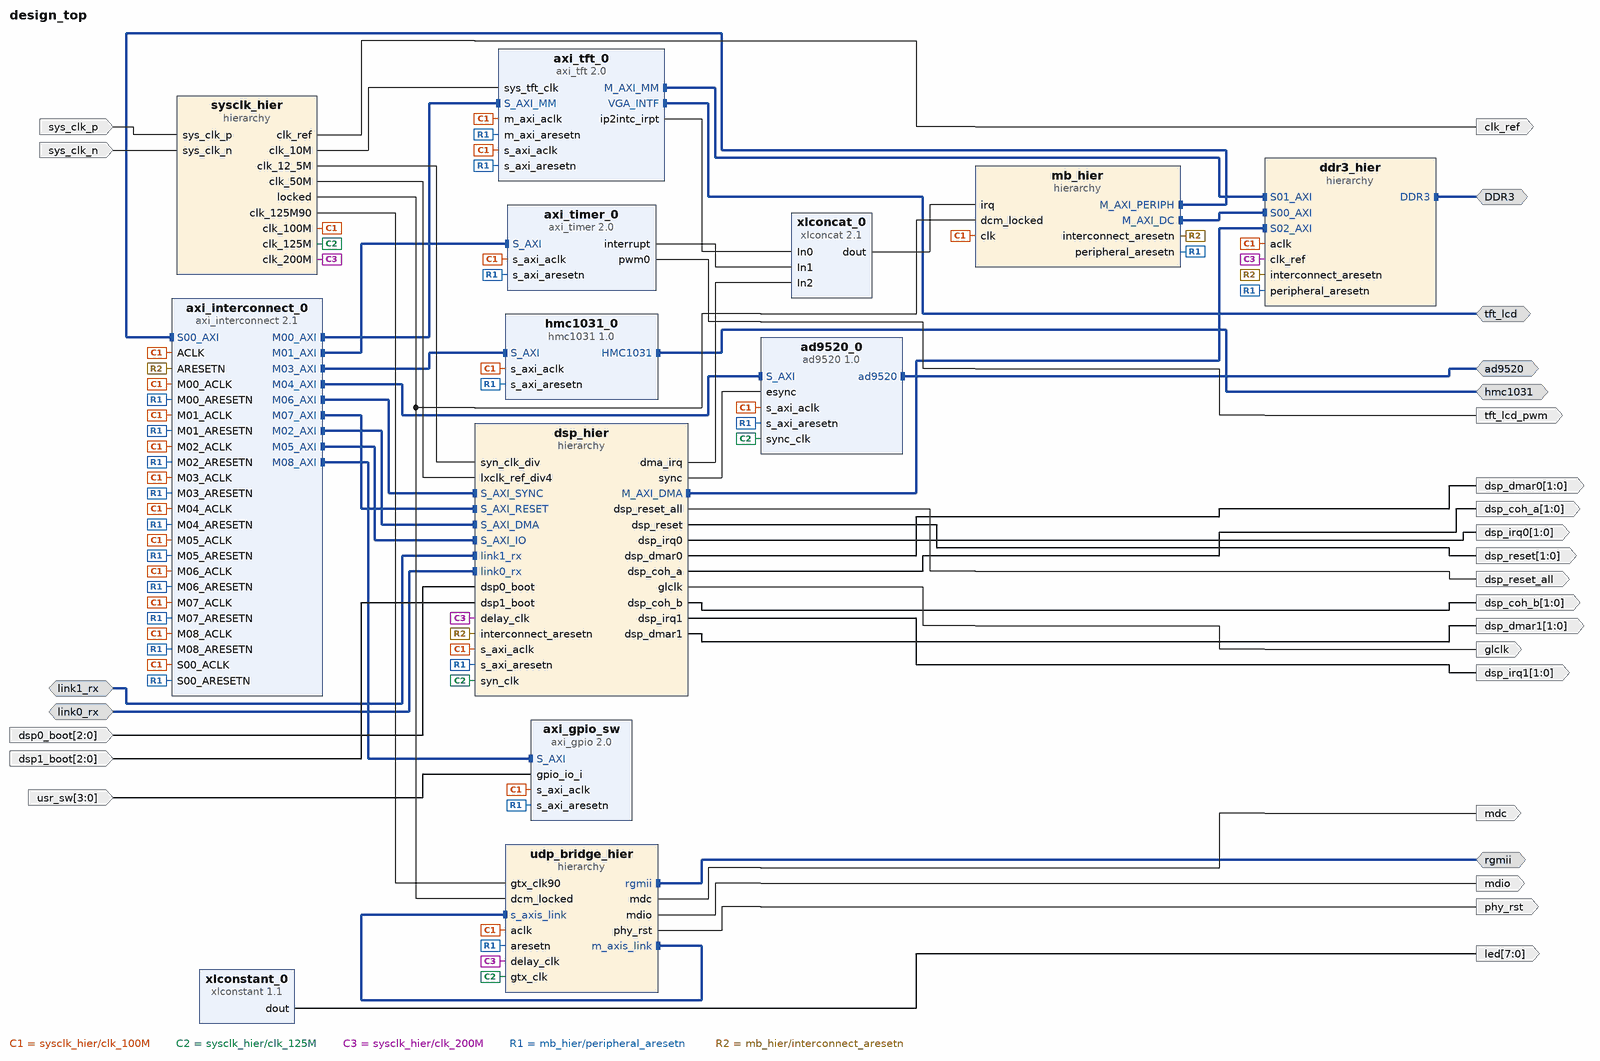
[diagram p0: block diagram of the top level]
# Vivado block design design_top, xc7a200tfbg484-2, Vivado 2018.3
create_bd_design design_top

create_bd_intf_port -mode Master -vlnv xilinx.com:interface:rgmii_rtl:1.0 rgmii
create_bd_intf_port -mode Master -vlnv xilinx.com:interface:ddrx_rtl:1.0 DDR3
create_bd_intf_port -mode Master -vlnv xilinx.com:interface:vga_rtl:1.0 tft_lcd
create_bd_intf_port -mode Slave -vlnv milandr.ru:interface:link_io_rtl:1.0 link0_rx
create_bd_intf_port -mode Slave -vlnv milandr.ru:interface:link_io_rtl:1.0 link1_rx
create_bd_intf_port -mode Master -vlnv milandr.ru:interface:hmc1031_rtl:1.0 hmc1031
create_bd_intf_port -mode Master -vlnv milandr.ru:interface:ad9520_io_rtl:1.0 ad9520
create_bd_port -dir I -type clk sys_clk_p
set_property -dict {CONFIG.FREQ_HZ 125000000} [get_bd_ports sys_clk_p]
create_bd_port -dir I -type clk sys_clk_n
set_property -dict {CONFIG.FREQ_HZ 125000000} [get_bd_ports sys_clk_n]
create_bd_port -dir O -from 7 -to 0 led
create_bd_port -dir O mdc
create_bd_port -dir O mdio
create_bd_port -dir O -type rst phy_rst
create_bd_port -dir O tft_lcd_pwm
create_bd_port -dir I -from 3 -to 0 usr_sw
create_bd_port -dir O clk_ref
create_bd_port -dir O -type clk glclk
set_property -dict {CONFIG.FREQ_HZ 12500000} [get_bd_ports glclk]
create_bd_port -dir O dsp_reset_all
create_bd_port -dir O -from 1 -to 0 -type rst dsp_reset
create_bd_port -dir O -from 1 -to 0 dsp_irq0
create_bd_port -dir O -from 1 -to 0 dsp_irq1
create_bd_port -dir O -from 1 -to 0 dsp_dmar0
create_bd_port -dir O -from 1 -to 0 dsp_dmar1
create_bd_port -dir O -from 1 -to 0 dsp_coh_a
create_bd_port -dir O -from 1 -to 0 dsp_coh_b
create_bd_port -dir I -from 2 -to 0 dsp0_boot
create_bd_port -dir I -from 2 -to 0 dsp1_boot

create_bd_cell -type hier udp_bridge_hier
create_bd_cell -type ip -vlnv xilinx.com:ip:xlconcat:2.1 xlconcat_0
set_property -dict {CONFIG.NUM_PORTS 3} [get_bd_cells xlconcat_0]
create_bd_cell -type hier mb_hier
create_bd_cell -type hier sysclk_hier
create_bd_cell -type hier ddr3_hier
create_bd_cell -type ip -vlnv xilinx.com:ip:axi_tft:2.0 axi_tft_0
set_property -dict {CONFIG.C_EN_I2C_INTF 0 CONFIG.C_M_AXI_DATA_WIDTH 32 CONFIG.C_TFT_INTERFACE 0} [get_bd_cells axi_tft_0]
create_bd_cell -type ip -vlnv xilinx.com:ip:axi_interconnect:2.1 axi_interconnect_0
set_property -dict {CONFIG.NUM_MI 9} [get_bd_cells axi_interconnect_0]
create_bd_cell -type ip -vlnv xilinx.com:ip:axi_timer:2.0 axi_timer_0
set_property -dict {CONFIG.enable_timer2 1} [get_bd_cells axi_timer_0]
create_bd_cell -type ip -vlnv milandr.ru:ip:hmc1031:1.0 hmc1031_0
create_bd_cell -type ip -vlnv milandr.ru:ip:ad9520:1.0 ad9520_0
set_property -dict {CONFIG.IS_AD_EEPROM_PRESENT false CONFIG.SPI_CLOCK_PRESCALER 100} [get_bd_cells ad9520_0]
create_bd_cell -type hier dsp_hier
create_bd_cell -type ip -vlnv xilinx.com:ip:axi_gpio:2.0 axi_gpio_sw
set_property -dict {CONFIG.C_ALL_INPUTS 1 CONFIG.C_GPIO_WIDTH 4} [get_bd_cells axi_gpio_sw]
create_bd_cell -type ip -vlnv xilinx.com:ip:xlconstant:1.1 xlconstant_0
set_property -dict {CONFIG.CONST_VAL 0xFF CONFIG.CONST_WIDTH 8} [get_bd_cells xlconstant_0]

# ---- hierarchy /udp_bridge_hier ----
current_bd_instance /udp_bridge_hier
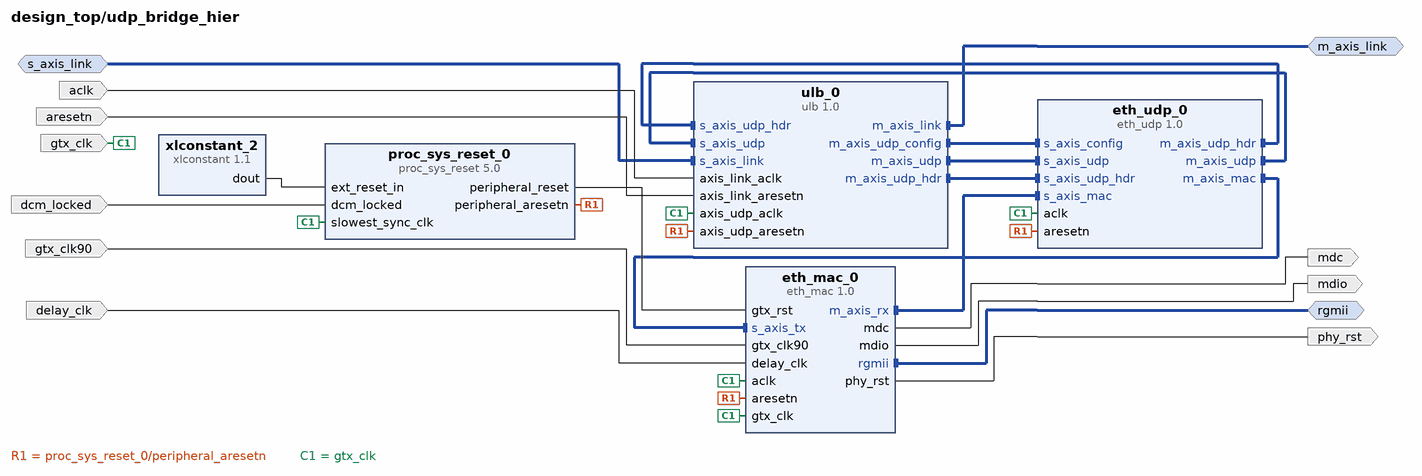
[diagram p1: block diagram inside /udp_bridge_hier]
create_bd_intf_pin -mode Master -vlnv xilinx.com:interface:rgmii_rtl:1.0 rgmii
create_bd_intf_pin -mode Slave -vlnv xilinx.com:interface:axis_rtl:1.0 s_axis_link
create_bd_intf_pin -mode Master -vlnv xilinx.com:interface:axis_rtl:1.0 m_axis_link
create_bd_pin -dir I -type clk gtx_clk
create_bd_pin -dir I -type clk aclk
create_bd_pin -dir I -type rst aresetn
create_bd_pin -dir I dcm_locked
create_bd_pin -dir I gtx_clk90
create_bd_pin -dir I -type clk delay_clk
create_bd_pin -dir O mdc
create_bd_pin -dir O mdio
create_bd_pin -dir O -type rst phy_rst

create_bd_cell -type ip -vlnv milandr.ru:ip:ulb:1.0 ulb_0
set_property -dict {CONFIG.CONFIG_ENABLE 1} [get_bd_cells ulb_0]
create_bd_cell -type ip -vlnv milandr.ru:ip:eth_udp:1.0 eth_udp_0
create_bd_cell -type ip -vlnv xilinx.com:ip:xlconstant:1.1 xlconstant_2
create_bd_cell -type ip -vlnv xilinx.com:ip:proc_sys_reset:5.0 proc_sys_reset_0
create_bd_cell -type ip -vlnv milandr.ru:ip:eth_mac:1.0 eth_mac_0
set_property -dict {CONFIG.USE_DELAY_CTRL 1} [get_bd_cells eth_mac_0]

# ---- hierarchy /mb_hier ----
current_bd_instance /mb_hier
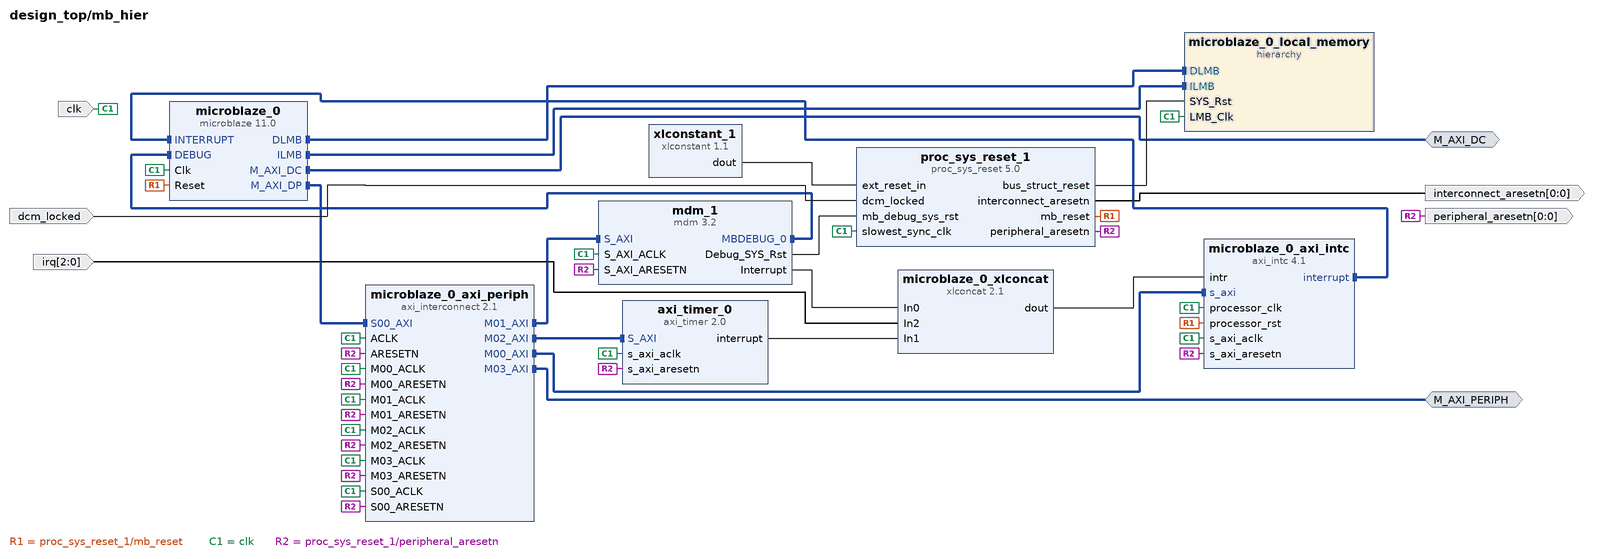
[diagram p2: block diagram inside /mb_hier]
create_bd_intf_pin -mode Master -vlnv xilinx.com:interface:aximm_rtl:1.0 M_AXI_DC
create_bd_intf_pin -mode Master -vlnv xilinx.com:interface:aximm_rtl:1.0 M_AXI_PERIPH
create_bd_pin -dir I -type clk clk
create_bd_pin -dir O -from 0 -to 0 -type rst peripheral_aresetn
create_bd_pin -dir I -from 2 -to 0 irq
create_bd_pin -dir I dcm_locked
create_bd_pin -dir O -from 0 -to 0 -type rst interconnect_aresetn

create_bd_cell -type ip -vlnv xilinx.com:ip:mdm:3.2 mdm_1
set_property -dict {CONFIG.C_ADDR_SIZE 32 CONFIG.C_M_AXI_ADDR_WIDTH 32 CONFIG.C_USE_UART 1} [get_bd_cells mdm_1]
create_bd_cell -type ip -vlnv xilinx.com:ip:xlconstant:1.1 xlconstant_1
create_bd_cell -type ip -vlnv xilinx.com:ip:xlconcat:2.1 microblaze_0_xlconcat
set_property -dict {CONFIG.NUM_PORTS 3} [get_bd_cells microblaze_0_xlconcat]
create_bd_cell -type ip -vlnv xilinx.com:ip:microblaze:11.0 microblaze_0
set_property -dict [list \
  CONFIG.C_ADDR_TAG_BITS 0 \
  CONFIG.C_DCACHE_ADDR_TAG 16 \
  CONFIG.C_DEBUG_ENABLED 1 \
  CONFIG.C_D_AXI 1 \
  CONFIG.C_D_LMB 1 \
  CONFIG.C_I_LMB 1 \
  CONFIG.C_USE_BARREL 1 \
  CONFIG.C_USE_BRANCH_TARGET_CACHE 1 \
  CONFIG.C_USE_DCACHE 1 \
  CONFIG.C_USE_DIV 1 \
  CONFIG.C_USE_FPU 2 \
  CONFIG.C_USE_HW_MUL 1 \
  CONFIG.C_USE_ICACHE 0 \
  CONFIG.C_USE_MSR_INSTR 1 \
  CONFIG.C_USE_PCMP_INSTR 1 \
] [get_bd_cells microblaze_0]
create_bd_cell -type ip -vlnv xilinx.com:ip:axi_timer:2.0 axi_timer_0
create_bd_cell -type ip -vlnv xilinx.com:ip:proc_sys_reset:5.0 proc_sys_reset_1
create_bd_cell -type ip -vlnv xilinx.com:ip:axi_intc:4.1 microblaze_0_axi_intc
set_property -dict {CONFIG.C_HAS_FAST 1} [get_bd_cells microblaze_0_axi_intc]
create_bd_cell -type ip -vlnv xilinx.com:ip:axi_interconnect:2.1 microblaze_0_axi_periph
set_property -dict {CONFIG.NUM_MI 4} [get_bd_cells microblaze_0_axi_periph]
create_bd_cell -type hier microblaze_0_local_memory

# ---- hierarchy /mb_hier/microblaze_0_local_memory ----
current_bd_instance /mb_hier/microblaze_0_local_memory
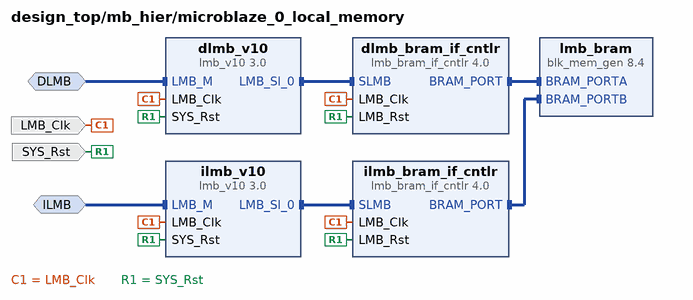
[diagram p3: block diagram inside /mb_hier/microblaze_0_local_memory]
create_bd_intf_pin -mode MirroredMaster -vlnv xilinx.com:interface:lmb_rtl:1.0 DLMB
create_bd_intf_pin -mode MirroredMaster -vlnv xilinx.com:interface:lmb_rtl:1.0 ILMB
create_bd_pin -dir I -type clk LMB_Clk
create_bd_pin -dir I -type rst SYS_Rst

create_bd_cell -type ip -vlnv xilinx.com:ip:lmb_v10:3.0 dlmb_v10
create_bd_cell -type ip -vlnv xilinx.com:ip:lmb_v10:3.0 ilmb_v10
create_bd_cell -type ip -vlnv xilinx.com:ip:lmb_bram_if_cntlr:4.0 dlmb_bram_if_cntlr
set_property -dict {CONFIG.C_ECC 0} [get_bd_cells dlmb_bram_if_cntlr]
create_bd_cell -type ip -vlnv xilinx.com:ip:lmb_bram_if_cntlr:4.0 ilmb_bram_if_cntlr
set_property -dict {CONFIG.C_ECC 0} [get_bd_cells ilmb_bram_if_cntlr]
create_bd_cell -type ip -vlnv xilinx.com:ip:blk_mem_gen:8.4 lmb_bram
set_property -dict {CONFIG.Memory_Type True_Dual_Port_RAM CONFIG.use_bram_block BRAM_Controller} [get_bd_cells lmb_bram]

# ---- hierarchy /sysclk_hier ----
current_bd_instance /sysclk_hier
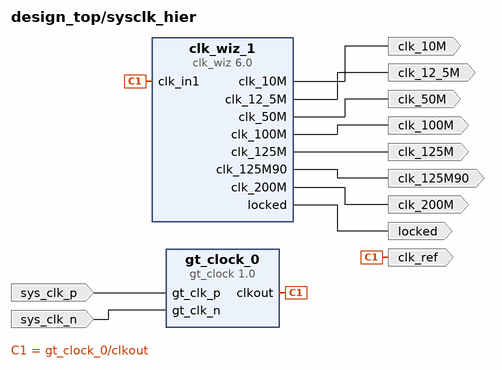
[diagram p4: block diagram inside /sysclk_hier]
create_bd_pin -dir I -type clk sys_clk_p
create_bd_pin -dir I -type clk sys_clk_n
create_bd_pin -dir O -type clk clk_100M
create_bd_pin -dir O -type clk clk_125M
create_bd_pin -dir O -type clk clk_125M90
create_bd_pin -dir O -type clk clk_200M
create_bd_pin -dir O locked
create_bd_pin -dir O -type clk clk_10M
create_bd_pin -dir O clk_ref
create_bd_pin -dir O -type clk clk_50M
create_bd_pin -dir O -type clk clk_12_5M

create_bd_cell -type ip -vlnv milandr.ru:ip:gt_clock:1.0 gt_clock_0
create_bd_cell -type ip -vlnv xilinx.com:ip:clk_wiz:6.0 clk_wiz_1
set_property -dict [list \
  CONFIG.CLKIN1_JITTER_PS 80.0 \
  CONFIG.CLKOUT1_JITTER 124.615 \
  CONFIG.CLKOUT1_PHASE_ERROR 96.948 \
  CONFIG.CLKOUT1_USED true \
  CONFIG.CLKOUT2_JITTER 119.348 \
  CONFIG.CLKOUT2_PHASE_ERROR 96.948 \
  CONFIG.CLKOUT2_REQUESTED_OUT_FREQ 125.000 \
  CONFIG.CLKOUT2_USED true \
  CONFIG.CLKOUT3_JITTER 119.348 \
  CONFIG.CLKOUT3_PHASE_ERROR 96.948 \
  CONFIG.CLKOUT3_REQUESTED_OUT_FREQ 125.000 \
  CONFIG.CLKOUT3_REQUESTED_PHASE 90 \
  CONFIG.CLKOUT3_USED true \
  CONFIG.CLKOUT4_JITTER 109.241 \
  CONFIG.CLKOUT4_PHASE_ERROR 96.948 \
  CONFIG.CLKOUT4_REQUESTED_OUT_FREQ 200.000 \
  CONFIG.CLKOUT4_USED true \
  CONFIG.CLKOUT5_JITTER 197.700 \
  CONFIG.CLKOUT5_PHASE_ERROR 96.948 \
  CONFIG.CLKOUT5_REQUESTED_OUT_FREQ 10.000 \
  CONFIG.CLKOUT5_USED true \
  CONFIG.CLKOUT6_JITTER 143.688 \
  CONFIG.CLKOUT6_PHASE_ERROR 96.948 \
  CONFIG.CLKOUT6_REQUESTED_OUT_FREQ 50.000 \
  CONFIG.CLKOUT6_USED true \
  CONFIG.CLKOUT7_JITTER 189.342 \
  CONFIG.CLKOUT7_PHASE_ERROR 96.948 \
  CONFIG.CLKOUT7_REQUESTED_OUT_FREQ 12.5 \
  CONFIG.CLKOUT7_USED true \
  CONFIG.CLK_OUT1_PORT clk_100M \
  CONFIG.CLK_OUT2_PORT clk_125M \
  CONFIG.CLK_OUT3_PORT clk_125M90 \
  CONFIG.CLK_OUT4_PORT clk_200M \
  CONFIG.CLK_OUT5_PORT clk_10M \
  CONFIG.CLK_OUT6_PORT clk_50M \
  CONFIG.CLK_OUT7_PORT clk_12_5M \
  CONFIG.MMCM_CLKFBOUT_MULT_F 8.000 \
  CONFIG.MMCM_CLKIN1_PERIOD 8.000 \
  CONFIG.MMCM_CLKOUT1_DIVIDE 8 \
  CONFIG.MMCM_CLKOUT2_DIVIDE 8 \
  CONFIG.MMCM_CLKOUT2_PHASE 90.000 \
  CONFIG.MMCM_CLKOUT3_DIVIDE 5 \
  CONFIG.MMCM_CLKOUT4_DIVIDE 100 \
  CONFIG.MMCM_CLKOUT5_DIVIDE 20 \
  CONFIG.MMCM_CLKOUT6_DIVIDE 80 \
  CONFIG.MMCM_DIVCLK_DIVIDE 1 \
  CONFIG.NUM_OUT_CLKS 7 \
  CONFIG.PRIM_IN_FREQ 125 \
  CONFIG.PRIM_SOURCE No_buffer \
  CONFIG.USE_RESET false \
] [get_bd_cells clk_wiz_1]

# ---- hierarchy /ddr3_hier ----
current_bd_instance /ddr3_hier
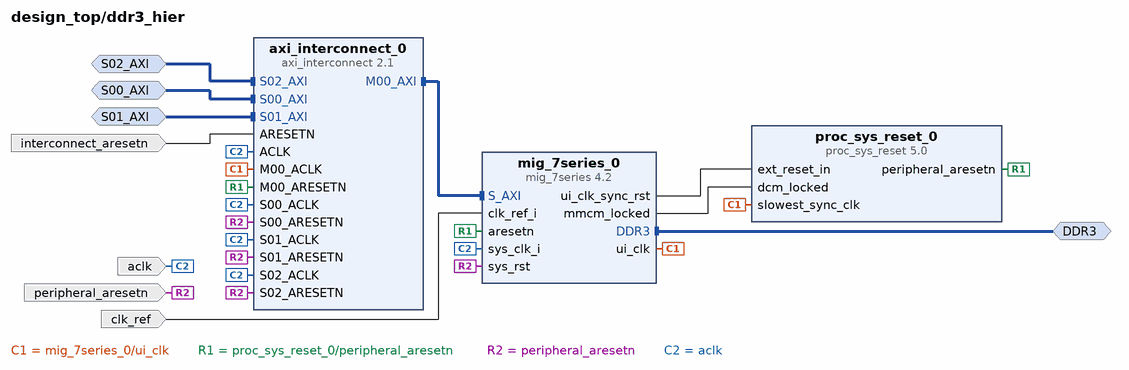
[diagram p5: block diagram inside /ddr3_hier]
create_bd_intf_pin -mode Slave -vlnv xilinx.com:interface:aximm_rtl:1.0 S00_AXI
create_bd_intf_pin -mode Master -vlnv xilinx.com:interface:ddrx_rtl:1.0 DDR3
create_bd_intf_pin -mode Slave -vlnv xilinx.com:interface:aximm_rtl:1.0 S01_AXI
create_bd_intf_pin -mode Slave -vlnv xilinx.com:interface:aximm_rtl:1.0 S02_AXI
create_bd_pin -dir I -type rst peripheral_aresetn
create_bd_pin -dir I -type clk aclk
create_bd_pin -dir I -type rst interconnect_aresetn
create_bd_pin -dir I -type clk clk_ref

create_bd_cell -type ip -vlnv xilinx.com:ip:proc_sys_reset:5.0 proc_sys_reset_0
create_bd_cell -type ip -vlnv xilinx.com:ip:mig_7series:4.2 mig_7series_0
set_property -dict [list \
  CONFIG.BOARD_MIG_PARAM Custom \
  CONFIG.RESET_BOARD_INTERFACE Custom \
  CONFIG.XML_INPUT_FILE mig_a.prj \
] [get_bd_cells mig_7series_0]
create_bd_cell -type ip -vlnv xilinx.com:ip:axi_interconnect:2.1 axi_interconnect_0
set_property -dict {CONFIG.NUM_MI 1 CONFIG.NUM_SI 3} [get_bd_cells axi_interconnect_0]

# ---- hierarchy /dsp_hier ----
current_bd_instance /dsp_hier
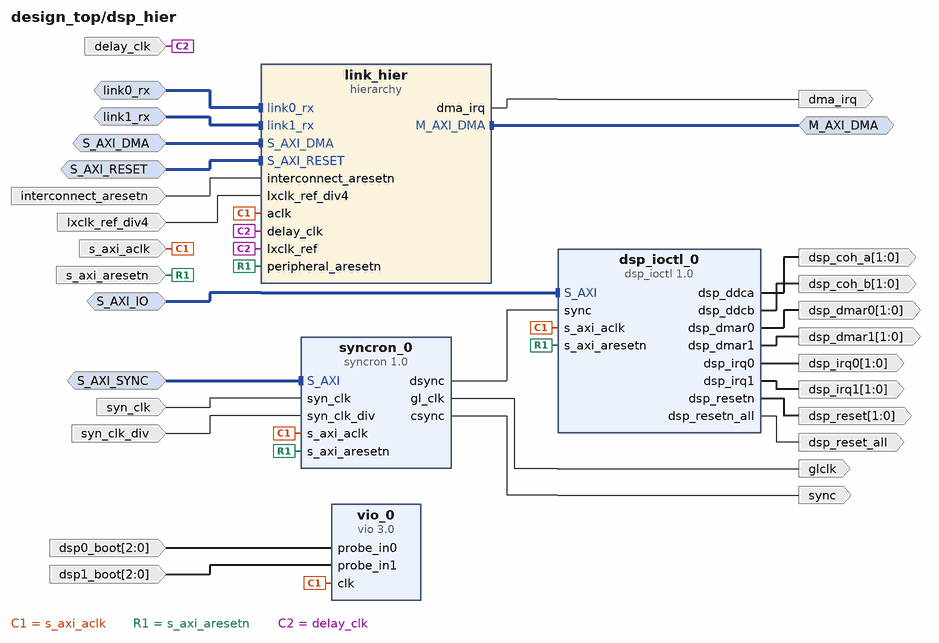
[diagram p6: block diagram inside /dsp_hier]
create_bd_intf_pin -mode Slave -vlnv xilinx.com:interface:aximm_rtl:1.0 S_AXI_IO
create_bd_intf_pin -mode Slave -vlnv xilinx.com:interface:aximm_rtl:1.0 S_AXI_SYNC
create_bd_intf_pin -mode Slave -vlnv milandr.ru:interface:link_io_rtl:1.0 link0_rx
create_bd_intf_pin -mode Slave -vlnv milandr.ru:interface:link_io_rtl:1.0 link1_rx
create_bd_intf_pin -mode Slave -vlnv xilinx.com:interface:aximm_rtl:1.0 S_AXI_RESET
create_bd_intf_pin -mode Master -vlnv xilinx.com:interface:aximm_rtl:1.0 M_AXI_DMA
create_bd_intf_pin -mode Slave -vlnv xilinx.com:interface:aximm_rtl:1.0 S_AXI_DMA
create_bd_pin -dir O -from 1 -to 0 -type rst dsp_reset
create_bd_pin -dir O dsp_reset_all
create_bd_pin -dir O -from 1 -to 0 dsp_irq0
create_bd_pin -dir O -from 1 -to 0 dsp_irq1
create_bd_pin -dir O -from 1 -to 0 dsp_dmar0
create_bd_pin -dir O -from 1 -to 0 dsp_dmar1
create_bd_pin -dir O -from 1 -to 0 dsp_coh_a
create_bd_pin -dir O -from 1 -to 0 dsp_coh_b
create_bd_pin -dir I -type clk s_axi_aclk
create_bd_pin -dir I -type rst s_axi_aresetn
create_bd_pin -dir I syn_clk
create_bd_pin -dir I syn_clk_div
create_bd_pin -dir O glclk
create_bd_pin -dir O sync
create_bd_pin -dir O -type intr dma_irq
create_bd_pin -dir I -type rst interconnect_aresetn
create_bd_pin -dir I delay_clk
create_bd_pin -dir I lxclk_ref_div4
create_bd_pin -dir I -from 2 -to 0 dsp0_boot
create_bd_pin -dir I -from 2 -to 0 dsp1_boot

create_bd_cell -type ip -vlnv milandr.ru:ip:dsp_ioctl:1.0 dsp_ioctl_0
create_bd_cell -type ip -vlnv milandr.ru:ip:syncron:1.0 syncron_0
set_property -dict [list \
  CONFIG.SYNC_CAP_DDC_DDELAY 250 \
  CONFIG.SYNC_CAP_DDC_DWIDTH 5 \
  CONFIG.SYNC_CAP_LNK_DWIDTH 5 \
  CONFIG.SYNC_CLK_WIDTH 5 \
  CONFIG.SYNC_LNK_CDELAY 0 \
  CONFIG.SYNC_LNK_CWIDTH 100 \
  CONFIG.SYNC_LNK_DWIDTH 5 \
] [get_bd_cells syncron_0]
create_bd_cell -type hier link_hier
create_bd_cell -type ip -vlnv xilinx.com:ip:vio:3.0 vio_0
set_property -dict {CONFIG.C_NUM_PROBE_IN 2 CONFIG.C_NUM_PROBE_OUT 0} [get_bd_cells vio_0]

# ---- hierarchy /dsp_hier/link_hier ----
current_bd_instance /dsp_hier/link_hier
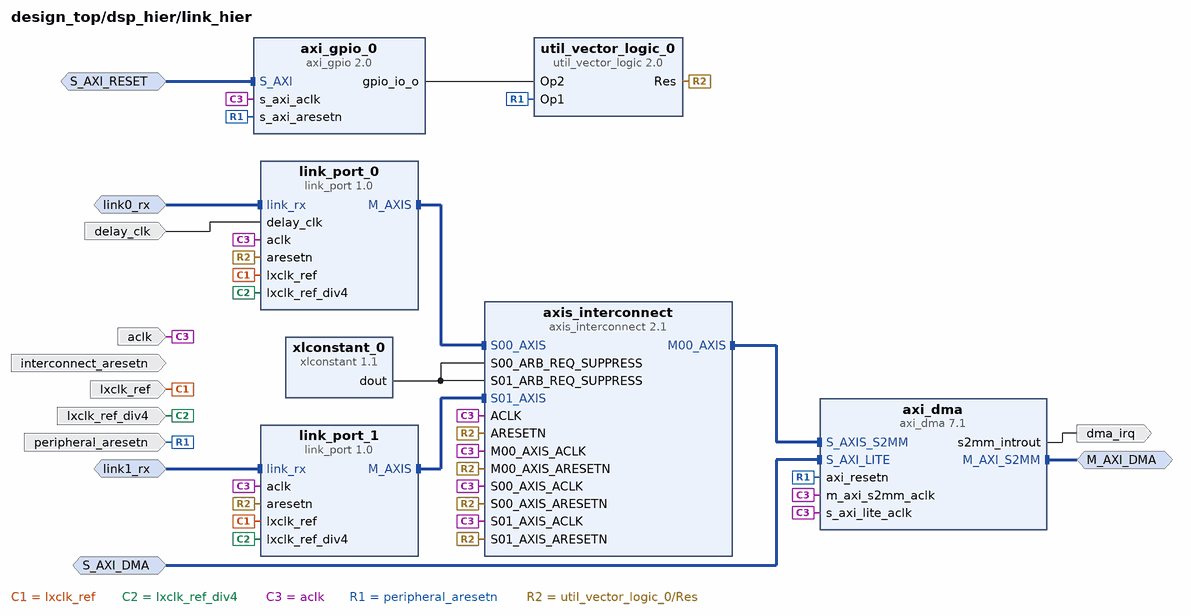
[diagram p7: block diagram inside /dsp_hier/link_hier]
create_bd_intf_pin -mode Slave -vlnv milandr.ru:interface:link_io_rtl:1.0 link0_rx
create_bd_intf_pin -mode Slave -vlnv milandr.ru:interface:link_io_rtl:1.0 link1_rx
create_bd_intf_pin -mode Slave -vlnv xilinx.com:interface:aximm_rtl:1.0 S_AXI_DMA
create_bd_intf_pin -mode Master -vlnv xilinx.com:interface:aximm_rtl:1.0 M_AXI_DMA
create_bd_intf_pin -mode Slave -vlnv xilinx.com:interface:aximm_rtl:1.0 S_AXI_RESET
create_bd_pin -dir I lxclk_ref
create_bd_pin -dir I lxclk_ref_div4
create_bd_pin -dir I -type clk aclk
create_bd_pin -dir I -type rst peripheral_aresetn
create_bd_pin -dir O -type intr dma_irq
create_bd_pin -dir I -type rst interconnect_aresetn
create_bd_pin -dir I delay_clk

create_bd_cell -type ip -vlnv milandr.ru:ip:link_port:1.0 link_port_0
set_property -dict {CONFIG.BCMP_RX_USE true CONFIG.DELAY_CTRL_INST true CONFIG.LINK_TX_INST false} [get_bd_cells link_port_0]
create_bd_cell -type ip -vlnv milandr.ru:ip:link_port:1.0 link_port_1
set_property -dict {CONFIG.BCMP_RX_USE true CONFIG.LINK_TX_INST false} [get_bd_cells link_port_1]
create_bd_cell -type ip -vlnv xilinx.com:ip:axi_dma:7.1 axi_dma
set_property -dict [list \
  CONFIG.c_include_mm2s 0 \
  CONFIG.c_include_sg 0 \
  CONFIG.c_s2mm_burst_size 64 \
  CONFIG.c_sg_length_width 24 \
] [get_bd_cells axi_dma]
create_bd_cell -type ip -vlnv xilinx.com:ip:axis_interconnect:2.1 axis_interconnect
set_property -dict [list \
  CONFIG.ARB_ON_MAX_XFERS 0 \
  CONFIG.ARB_ON_TLAST 1 \
  CONFIG.NUM_MI 1 \
  CONFIG.NUM_SI 2 \
] [get_bd_cells axis_interconnect]
create_bd_cell -type ip -vlnv xilinx.com:ip:xlconstant:1.1 xlconstant_0
set_property -dict {CONFIG.CONST_VAL 0} [get_bd_cells xlconstant_0]
create_bd_cell -type ip -vlnv xilinx.com:ip:axi_gpio:2.0 axi_gpio_0
set_property -dict {CONFIG.C_ALL_OUTPUTS 1 CONFIG.C_GPIO_WIDTH 1} [get_bd_cells axi_gpio_0]
create_bd_cell -type ip -vlnv xilinx.com:ip:util_vector_logic:2.0 util_vector_logic_0
set_property -dict {CONFIG.C_SIZE 1} [get_bd_cells util_vector_logic_0]

# ---- connections ----

current_bd_instance /udp_bridge_hier
connect_bd_intf_net [get_bd_intf_pins rgmii] [get_bd_intf_pins eth_mac_0/rgmii]
connect_bd_intf_net [get_bd_intf_pins eth_mac_0/s_axis_tx] [get_bd_intf_pins eth_udp_0/m_axis_mac]
connect_bd_intf_net [get_bd_intf_pins m_axis_link] [get_bd_intf_pins ulb_0/m_axis_link]
connect_bd_intf_net [get_bd_intf_pins s_axis_link] [get_bd_intf_pins ulb_0/s_axis_link]
connect_bd_intf_net [get_bd_intf_pins ulb_0/s_axis_udp_hdr] [get_bd_intf_pins eth_udp_0/m_axis_udp_hdr]
connect_bd_intf_net [get_bd_intf_pins ulb_0/s_axis_udp] [get_bd_intf_pins eth_udp_0/m_axis_udp]
connect_bd_intf_net [get_bd_intf_pins eth_mac_0/m_axis_rx] [get_bd_intf_pins eth_udp_0/s_axis_mac]
connect_bd_intf_net [get_bd_intf_pins ulb_0/m_axis_udp_config] [get_bd_intf_pins eth_udp_0/s_axis_config]
connect_bd_intf_net [get_bd_intf_pins ulb_0/m_axis_udp] [get_bd_intf_pins eth_udp_0/s_axis_udp]
connect_bd_intf_net [get_bd_intf_pins ulb_0/m_axis_udp_hdr] [get_bd_intf_pins eth_udp_0/s_axis_udp_hdr]
connect_bd_net [get_bd_pins proc_sys_reset_0/peripheral_aresetn] \
  [get_bd_pins eth_mac_0/aresetn] [get_bd_pins eth_udp_0/aresetn] [get_bd_pins ulb_0/axis_udp_aresetn]
connect_bd_net [get_bd_pins xlconstant_2/dout] [get_bd_pins proc_sys_reset_0/ext_reset_in]
connect_bd_net [get_bd_pins proc_sys_reset_0/peripheral_reset] [get_bd_pins eth_mac_0/gtx_rst]
connect_bd_net -net clk_wiz_1_clk_125M [get_bd_pins gtx_clk] \
  [get_bd_pins proc_sys_reset_0/slowest_sync_clk] [get_bd_pins eth_mac_0/aclk] [get_bd_pins eth_mac_0/gtx_clk] \
  [get_bd_pins eth_udp_0/aclk] [get_bd_pins ulb_0/axis_udp_aclk]
connect_bd_net -net clk_wiz_1_clk_100M [get_bd_pins aclk] [get_bd_pins ulb_0/axis_link_aclk]
connect_bd_net -net proc_sys_reset_1_peripheral_aresetn [get_bd_pins aresetn] [get_bd_pins ulb_0/axis_link_aresetn]
connect_bd_net -net clk_wiz_1_locked [get_bd_pins dcm_locked] [get_bd_pins proc_sys_reset_0/dcm_locked]
connect_bd_net -net clk_wiz_1_clk_125M90 [get_bd_pins gtx_clk90] [get_bd_pins eth_mac_0/gtx_clk90]
connect_bd_net -net clk_wiz_1_clk_200M [get_bd_pins delay_clk] [get_bd_pins eth_mac_0/delay_clk]
connect_bd_net [get_bd_pins eth_mac_0/mdc] [get_bd_pins mdc]
connect_bd_net [get_bd_pins eth_mac_0/mdio] [get_bd_pins mdio]
connect_bd_net [get_bd_pins eth_mac_0/phy_rst] [get_bd_pins phy_rst]

current_bd_instance /mb_hier
connect_bd_intf_net [get_bd_intf_pins microblaze_0/DLMB] [get_bd_intf_pins microblaze_0_local_memory/DLMB]
connect_bd_intf_net [get_bd_intf_pins microblaze_0/ILMB] [get_bd_intf_pins microblaze_0_local_memory/ILMB]
connect_bd_intf_net [get_bd_intf_pins microblaze_0_axi_periph/M02_AXI] [get_bd_intf_pins axi_timer_0/S_AXI]
connect_bd_intf_net -intf_net microblaze_0_intc_axi [get_bd_intf_pins microblaze_0_axi_periph/M00_AXI] [get_bd_intf_pins microblaze_0_axi_intc/s_axi]
connect_bd_intf_net [get_bd_intf_pins microblaze_0_axi_intc/interrupt] [get_bd_intf_pins microblaze_0/INTERRUPT]
connect_bd_intf_net -intf_net microblaze_0_axi_dp [get_bd_intf_pins microblaze_0_axi_periph/S00_AXI] [get_bd_intf_pins microblaze_0/M_AXI_DP]
connect_bd_intf_net [get_bd_intf_pins mdm_1/MBDEBUG_0] [get_bd_intf_pins microblaze_0/DEBUG]
connect_bd_intf_net -intf_net microblaze_0_mdm_axi [get_bd_intf_pins microblaze_0_axi_periph/M01_AXI] [get_bd_intf_pins mdm_1/S_AXI]
connect_bd_intf_net [get_bd_intf_pins M_AXI_DC] [get_bd_intf_pins microblaze_0/M_AXI_DC]
connect_bd_intf_net [get_bd_intf_pins M_AXI_PERIPH] [get_bd_intf_pins microblaze_0_axi_periph/M03_AXI]
connect_bd_net [get_bd_pins mdm_1/Interrupt] [get_bd_pins microblaze_0_xlconcat/In0]
connect_bd_net [get_bd_pins mdm_1/Debug_SYS_Rst] [get_bd_pins proc_sys_reset_1/mb_debug_sys_rst]
connect_bd_net [get_bd_pins xlconstant_1/dout] [get_bd_pins proc_sys_reset_1/ext_reset_in]
connect_bd_net [get_bd_pins axi_timer_0/interrupt] [get_bd_pins microblaze_0_xlconcat/In1]
connect_bd_net -net microblaze_0_intr [get_bd_pins microblaze_0_xlconcat/dout] [get_bd_pins microblaze_0_axi_intc/intr]
connect_bd_net [get_bd_pins proc_sys_reset_1/mb_reset] [get_bd_pins microblaze_0/Reset] [get_bd_pins microblaze_0_axi_intc/processor_rst]
connect_bd_net [get_bd_pins proc_sys_reset_1/bus_struct_reset] [get_bd_pins microblaze_0_local_memory/SYS_Rst]
connect_bd_net -net microblaze_0_Clk [get_bd_pins clk] \
  [get_bd_pins proc_sys_reset_1/slowest_sync_clk] [get_bd_pins microblaze_0/Clk] [get_bd_pins microblaze_0_axi_periph/ACLK] \
  [get_bd_pins microblaze_0_axi_periph/S00_ACLK] [get_bd_pins microblaze_0_axi_periph/M00_ACLK] \
  [get_bd_pins microblaze_0_axi_periph/M01_ACLK] [get_bd_pins microblaze_0_axi_intc/s_axi_aclk] \
  [get_bd_pins microblaze_0_axi_intc/processor_clk] [get_bd_pins microblaze_0_local_memory/LMB_Clk] \
  [get_bd_pins axi_timer_0/s_axi_aclk] [get_bd_pins microblaze_0_axi_periph/M02_ACLK] [get_bd_pins mdm_1/S_AXI_ACLK] \
  [get_bd_pins microblaze_0_axi_periph/M03_ACLK]
connect_bd_net [get_bd_pins proc_sys_reset_1/peripheral_aresetn] \
  [get_bd_pins peripheral_aresetn] [get_bd_pins microblaze_0_axi_periph/ARESETN] \
  [get_bd_pins microblaze_0_axi_periph/S00_ARESETN] [get_bd_pins microblaze_0_axi_periph/M00_ARESETN] \
  [get_bd_pins microblaze_0_axi_periph/M01_ARESETN] [get_bd_pins microblaze_0_axi_intc/s_axi_aresetn] \
  [get_bd_pins axi_timer_0/s_axi_aresetn] [get_bd_pins microblaze_0_axi_periph/M02_ARESETN] [get_bd_pins mdm_1/S_AXI_ARESETN] \
  [get_bd_pins microblaze_0_axi_periph/M03_ARESETN]
connect_bd_net -net xlconcat_0_dout [get_bd_pins irq] [get_bd_pins microblaze_0_xlconcat/In2]
connect_bd_net -net clk_wiz_1_locked [get_bd_pins dcm_locked] [get_bd_pins proc_sys_reset_1/dcm_locked]
connect_bd_net [get_bd_pins proc_sys_reset_1/interconnect_aresetn] [get_bd_pins interconnect_aresetn]
set_property HDL_ATTRIBUTE.BMM_INFO_PROCESSOR {microblaze-le > design_top mb_hier/microblaze_0_local_memory/dlmb_bram_if_cntlr} [get_bd_cells microblaze_0]
set_property HDL_ATTRIBUTE.KEEP_HIERARCHY yes [get_bd_cells microblaze_0]

current_bd_instance /mb_hier/microblaze_0_local_memory
connect_bd_intf_net -intf_net microblaze_0_ilmb [get_bd_intf_pins ILMB] [get_bd_intf_pins ilmb_v10/LMB_M]
connect_bd_intf_net -intf_net microblaze_0_dlmb_bus [get_bd_intf_pins dlmb_v10/LMB_Sl_0] [get_bd_intf_pins dlmb_bram_if_cntlr/SLMB]
connect_bd_intf_net -intf_net microblaze_0_ilmb_bus [get_bd_intf_pins ilmb_v10/LMB_Sl_0] [get_bd_intf_pins ilmb_bram_if_cntlr/SLMB]
connect_bd_intf_net -intf_net microblaze_0_dlmb_cntlr [get_bd_intf_pins dlmb_bram_if_cntlr/BRAM_PORT] [get_bd_intf_pins lmb_bram/BRAM_PORTA]
connect_bd_intf_net -intf_net microblaze_0_ilmb_cntlr [get_bd_intf_pins ilmb_bram_if_cntlr/BRAM_PORT] [get_bd_intf_pins lmb_bram/BRAM_PORTB]
connect_bd_intf_net -intf_net microblaze_0_dlmb [get_bd_intf_pins DLMB] [get_bd_intf_pins dlmb_v10/LMB_M]
connect_bd_net -net microblaze_0_Clk [get_bd_pins LMB_Clk] \
  [get_bd_pins dlmb_v10/LMB_Clk] [get_bd_pins dlmb_bram_if_cntlr/LMB_Clk] [get_bd_pins ilmb_v10/LMB_Clk] \
  [get_bd_pins ilmb_bram_if_cntlr/LMB_Clk]
connect_bd_net [get_bd_pins SYS_Rst] \
  [get_bd_pins dlmb_v10/SYS_Rst] [get_bd_pins dlmb_bram_if_cntlr/LMB_Rst] [get_bd_pins ilmb_v10/SYS_Rst] \
  [get_bd_pins ilmb_bram_if_cntlr/LMB_Rst]
set_property HDL_ATTRIBUTE.BMM_INFO_ADDRESS_SPACE {byte  0x00000000 32 > design_top mb_hier/microblaze_0_local_memory/lmb_bram} [get_bd_cells dlmb_bram_if_cntlr]
set_property HDL_ATTRIBUTE.KEEP_HIERARCHY yes [get_bd_cells dlmb_bram_if_cntlr]

current_bd_instance /sysclk_hier
connect_bd_net [get_bd_pins sys_clk_p] [get_bd_pins gt_clock_0/gt_clk_p]
connect_bd_net [get_bd_pins sys_clk_n] [get_bd_pins gt_clock_0/gt_clk_n]
connect_bd_net [get_bd_pins gt_clock_0/clkout] [get_bd_pins clk_wiz_1/clk_in1] [get_bd_pins clk_ref]
connect_bd_net -net microblaze_0_Clk [get_bd_pins clk_wiz_1/clk_100M] [get_bd_pins clk_100M]
connect_bd_net [get_bd_pins clk_wiz_1/clk_125M] [get_bd_pins clk_125M]
connect_bd_net [get_bd_pins clk_wiz_1/clk_125M90] [get_bd_pins clk_125M90]
connect_bd_net [get_bd_pins clk_wiz_1/clk_200M] [get_bd_pins clk_200M]
connect_bd_net [get_bd_pins clk_wiz_1/locked] [get_bd_pins locked]
connect_bd_net [get_bd_pins clk_wiz_1/clk_10M] [get_bd_pins clk_10M]
connect_bd_net [get_bd_pins clk_wiz_1/clk_50M] [get_bd_pins clk_50M]
connect_bd_net [get_bd_pins clk_wiz_1/clk_12_5M] [get_bd_pins clk_12_5M]

current_bd_instance /ddr3_hier
connect_bd_intf_net [get_bd_intf_pins S02_AXI] [get_bd_intf_pins axi_interconnect_0/S02_AXI]
connect_bd_intf_net [get_bd_intf_pins DDR3] [get_bd_intf_pins mig_7series_0/DDR3]
connect_bd_intf_net [get_bd_intf_pins axi_interconnect_0/M00_AXI] [get_bd_intf_pins mig_7series_0/S_AXI]
connect_bd_intf_net [get_bd_intf_pins S00_AXI] [get_bd_intf_pins axi_interconnect_0/S00_AXI]
connect_bd_intf_net [get_bd_intf_pins S01_AXI] [get_bd_intf_pins axi_interconnect_0/S01_AXI]
connect_bd_net [get_bd_pins mig_7series_0/ui_clk] [get_bd_pins proc_sys_reset_0/slowest_sync_clk] [get_bd_pins axi_interconnect_0/M00_ACLK]
connect_bd_net [get_bd_pins mig_7series_0/ui_clk_sync_rst] [get_bd_pins proc_sys_reset_0/ext_reset_in]
connect_bd_net [get_bd_pins mig_7series_0/mmcm_locked] [get_bd_pins proc_sys_reset_0/dcm_locked]
connect_bd_net [get_bd_pins proc_sys_reset_0/peripheral_aresetn] [get_bd_pins mig_7series_0/aresetn] [get_bd_pins axi_interconnect_0/M00_ARESETN]
connect_bd_net -net proc_sys_reset_1_peripheral_aresetn [get_bd_pins peripheral_aresetn] \
  [get_bd_pins axi_interconnect_0/S00_ARESETN] [get_bd_pins mig_7series_0/sys_rst] \
  [get_bd_pins axi_interconnect_0/S01_ARESETN] [get_bd_pins axi_interconnect_0/S02_ARESETN]
connect_bd_net -net microblaze_0_Clk [get_bd_pins aclk] \
  [get_bd_pins mig_7series_0/sys_clk_i] [get_bd_pins axi_interconnect_0/ACLK] [get_bd_pins axi_interconnect_0/S00_ACLK] \
  [get_bd_pins axi_interconnect_0/S01_ACLK] [get_bd_pins axi_interconnect_0/S02_ACLK]
connect_bd_net -net ARESETN_1 [get_bd_pins interconnect_aresetn] [get_bd_pins axi_interconnect_0/ARESETN]
connect_bd_net -net clk_ref_i_1 [get_bd_pins clk_ref] [get_bd_pins mig_7series_0/clk_ref_i]

current_bd_instance /dsp_hier
connect_bd_intf_net [get_bd_intf_pins link0_rx] [get_bd_intf_pins link_hier/link0_rx]
connect_bd_intf_net [get_bd_intf_pins link1_rx] [get_bd_intf_pins link_hier/link1_rx]
connect_bd_intf_net -intf_net axi_interconnect_0_M06_AXI [get_bd_intf_pins S_AXI_SYNC] [get_bd_intf_pins syncron_0/S_AXI]
connect_bd_intf_net [get_bd_intf_pins M_AXI_DMA] [get_bd_intf_pins link_hier/M_AXI_DMA]
connect_bd_intf_net [get_bd_intf_pins S_AXI_DMA] [get_bd_intf_pins link_hier/S_AXI_DMA]
connect_bd_intf_net [get_bd_intf_pins S_AXI_RESET] [get_bd_intf_pins link_hier/S_AXI_RESET]
connect_bd_intf_net -intf_net axi_interconnect_0_M05_AXI [get_bd_intf_pins S_AXI_IO] [get_bd_intf_pins dsp_ioctl_0/S_AXI]
connect_bd_net [get_bd_pins syncron_0/dsync] [get_bd_pins dsp_ioctl_0/sync]
connect_bd_net [get_bd_pins dsp_ioctl_0/dsp_resetn] [get_bd_pins dsp_reset]
connect_bd_net [get_bd_pins dsp_ioctl_0/dsp_resetn_all] [get_bd_pins dsp_reset_all]
connect_bd_net [get_bd_pins dsp_ioctl_0/dsp_irq0] [get_bd_pins dsp_irq0]
connect_bd_net [get_bd_pins dsp_ioctl_0/dsp_irq1] [get_bd_pins dsp_irq1]
connect_bd_net [get_bd_pins dsp_ioctl_0/dsp_dmar0] [get_bd_pins dsp_dmar0]
connect_bd_net [get_bd_pins dsp_ioctl_0/dsp_dmar1] [get_bd_pins dsp_dmar1]
connect_bd_net [get_bd_pins dsp_ioctl_0/dsp_ddca] [get_bd_pins dsp_coh_a]
connect_bd_net [get_bd_pins dsp_ioctl_0/dsp_ddcb] [get_bd_pins dsp_coh_b]
connect_bd_net -net microblaze_0_Clk [get_bd_pins s_axi_aclk] \
  [get_bd_pins syncron_0/s_axi_aclk] [get_bd_pins dsp_ioctl_0/s_axi_aclk] [get_bd_pins link_hier/aclk] \
  [get_bd_pins vio_0/clk]
connect_bd_net -net proc_sys_reset_1_peripheral_aresetn [get_bd_pins s_axi_aresetn] \
  [get_bd_pins syncron_0/s_axi_aresetn] [get_bd_pins dsp_ioctl_0/s_axi_aresetn] [get_bd_pins link_hier/peripheral_aresetn]
connect_bd_net -net clk_wiz_1_clk_125M [get_bd_pins syn_clk] [get_bd_pins syncron_0/syn_clk]
connect_bd_net -net sysclk_hier_clk_12_5M [get_bd_pins syn_clk_div] [get_bd_pins syncron_0/syn_clk_div]
connect_bd_net [get_bd_pins syncron_0/gl_clk] [get_bd_pins glclk]
connect_bd_net [get_bd_pins syncron_0/csync] [get_bd_pins sync]
connect_bd_net [get_bd_pins link_hier/dma_irq] [get_bd_pins dma_irq]
connect_bd_net [get_bd_pins interconnect_aresetn] [get_bd_pins link_hier/interconnect_aresetn]
connect_bd_net [get_bd_pins delay_clk] [get_bd_pins link_hier/delay_clk] [get_bd_pins link_hier/lxclk_ref]
connect_bd_net -net lxclk_ref_div4_1 [get_bd_pins lxclk_ref_div4] [get_bd_pins link_hier/lxclk_ref_div4]
connect_bd_net -net probe_in0_0_1 [get_bd_pins dsp0_boot] [get_bd_pins vio_0/probe_in0]
connect_bd_net -net probe_in1_0_1 [get_bd_pins dsp1_boot] [get_bd_pins vio_0/probe_in1]

current_bd_instance /dsp_hier/link_hier
connect_bd_intf_net -intf_net axis_interconnect_0_M00_AXIS [get_bd_intf_pins axis_interconnect/M00_AXIS] [get_bd_intf_pins axi_dma/S_AXIS_S2MM]
connect_bd_intf_net -intf_net axi_dma_0_M_AXI_S2MM [get_bd_intf_pins M_AXI_DMA] [get_bd_intf_pins axi_dma/M_AXI_S2MM]
connect_bd_intf_net -intf_net link_rx_0_1 [get_bd_intf_pins link0_rx] [get_bd_intf_pins link_port_0/link_rx]
connect_bd_intf_net [get_bd_intf_pins link_port_0/M_AXIS] [get_bd_intf_pins axis_interconnect/S00_AXIS]
connect_bd_intf_net [get_bd_intf_pins link_port_1/M_AXIS] [get_bd_intf_pins axis_interconnect/S01_AXIS]
connect_bd_intf_net -intf_net link_rx_1_1 [get_bd_intf_pins link1_rx] [get_bd_intf_pins link_port_1/link_rx]
connect_bd_intf_net [get_bd_intf_pins S_AXI_RESET] [get_bd_intf_pins axi_gpio_0/S_AXI]
connect_bd_intf_net -intf_net axi_interconnect_0_M02_AXI [get_bd_intf_pins S_AXI_DMA] [get_bd_intf_pins axi_dma/S_AXI_LITE]
connect_bd_net -net clk_wiz_1_clk_200M [get_bd_pins lxclk_ref] [get_bd_pins link_port_1/lxclk_ref] [get_bd_pins link_port_0/lxclk_ref]
connect_bd_net -net sysclk_hier_clk_50M [get_bd_pins lxclk_ref_div4] [get_bd_pins link_port_1/lxclk_ref_div4] [get_bd_pins link_port_0/lxclk_ref_div4]
connect_bd_net -net microblaze_0_Clk [get_bd_pins aclk] \
  [get_bd_pins link_port_1/aclk] [get_bd_pins axis_interconnect/ACLK] [get_bd_pins axis_interconnect/S00_AXIS_ACLK] \
  [get_bd_pins axis_interconnect/M00_AXIS_ACLK] [get_bd_pins axis_interconnect/S01_AXIS_ACLK] \
  [get_bd_pins axi_dma/s_axi_lite_aclk] [get_bd_pins axi_dma/m_axi_s2mm_aclk] [get_bd_pins link_port_0/aclk] \
  [get_bd_pins axi_gpio_0/s_axi_aclk]
connect_bd_net -net proc_sys_reset_1_peripheral_aresetn [get_bd_pins peripheral_aresetn] \
  [get_bd_pins axi_dma/axi_resetn] [get_bd_pins axi_gpio_0/s_axi_aresetn] [get_bd_pins util_vector_logic_0/Op1]
connect_bd_net -net axi_dma_0_s2mm_introut [get_bd_pins axi_dma/s2mm_introut] [get_bd_pins dma_irq]
connect_bd_net -net delay_clk_0_1 [get_bd_pins delay_clk] [get_bd_pins link_port_0/delay_clk]
connect_bd_net [get_bd_pins xlconstant_0/dout] \
  [get_bd_pins axis_interconnect/S00_ARB_REQ_SUPPRESS] [get_bd_pins axis_interconnect/S01_ARB_REQ_SUPPRESS]
connect_bd_net [get_bd_pins util_vector_logic_0/Res] \
  [get_bd_pins link_port_0/aresetn] [get_bd_pins link_port_1/aresetn] [get_bd_pins axis_interconnect/ARESETN] \
  [get_bd_pins axis_interconnect/S00_AXIS_ARESETN] [get_bd_pins axis_interconnect/M00_AXIS_ARESETN] \
  [get_bd_pins axis_interconnect/S01_AXIS_ARESETN]
connect_bd_net [get_bd_pins axi_gpio_0/gpio_io_o] [get_bd_pins util_vector_logic_0/Op2]

current_bd_instance /
connect_bd_intf_net [get_bd_intf_pins udp_bridge_hier/s_axis_link] [get_bd_intf_pins udp_bridge_hier/m_axis_link]
connect_bd_intf_net [get_bd_intf_pins axi_timer_0/S_AXI] [get_bd_intf_pins axi_interconnect_0/M01_AXI]
connect_bd_intf_net [get_bd_intf_pins ddr3_hier/S00_AXI] [get_bd_intf_pins mb_hier/M_AXI_DC]
connect_bd_intf_net [get_bd_intf_ports tft_lcd] [get_bd_intf_pins axi_tft_0/VGA_INTF]
connect_bd_intf_net -intf_net eth_mac_0_rgmii [get_bd_intf_ports rgmii] [get_bd_intf_pins udp_bridge_hier/rgmii]
connect_bd_intf_net [get_bd_intf_pins axi_tft_0/M_AXI_MM] [get_bd_intf_pins ddr3_hier/S01_AXI]
connect_bd_intf_net [get_bd_intf_pins axi_interconnect_0/M06_AXI] [get_bd_intf_pins dsp_hier/S_AXI_SYNC]
connect_bd_intf_net [get_bd_intf_ports link1_rx] [get_bd_intf_pins dsp_hier/link1_rx]
connect_bd_intf_net [get_bd_intf_pins axi_interconnect_0/M07_AXI] [get_bd_intf_pins dsp_hier/S_AXI_RESET]
connect_bd_intf_net [get_bd_intf_pins ddr3_hier/S02_AXI] [get_bd_intf_pins dsp_hier/M_AXI_DMA]
connect_bd_intf_net [get_bd_intf_pins axi_interconnect_0/M02_AXI] [get_bd_intf_pins dsp_hier/S_AXI_DMA]
connect_bd_intf_net [get_bd_intf_pins axi_interconnect_0/M05_AXI] [get_bd_intf_pins dsp_hier/S_AXI_IO]
connect_bd_intf_net [get_bd_intf_ports hmc1031] [get_bd_intf_pins hmc1031_0/HMC1031]
connect_bd_intf_net [get_bd_intf_pins axi_interconnect_0/M00_AXI] [get_bd_intf_pins axi_tft_0/S_AXI_MM]
connect_bd_intf_net [get_bd_intf_pins axi_interconnect_0/S00_AXI] [get_bd_intf_pins mb_hier/M_AXI_PERIPH]
connect_bd_intf_net [get_bd_intf_pins axi_interconnect_0/M03_AXI] [get_bd_intf_pins hmc1031_0/S_AXI]
connect_bd_intf_net [get_bd_intf_pins axi_interconnect_0/M04_AXI] [get_bd_intf_pins ad9520_0/S_AXI]
connect_bd_intf_net [get_bd_intf_ports ad9520] [get_bd_intf_pins ad9520_0/ad9520]
connect_bd_intf_net -intf_net ddr3_hier_DDR3_0 [get_bd_intf_ports DDR3] [get_bd_intf_pins ddr3_hier/DDR3]
connect_bd_intf_net [get_bd_intf_pins axi_interconnect_0/M08_AXI] [get_bd_intf_pins axi_gpio_sw/S_AXI]
connect_bd_intf_net [get_bd_intf_ports link0_rx] [get_bd_intf_pins dsp_hier/link0_rx]
connect_bd_net -net microblaze_0_Clk [get_bd_pins sysclk_hier/clk_100M] \
  [get_bd_pins udp_bridge_hier/aclk] [get_bd_pins mb_hier/clk] [get_bd_pins ddr3_hier/aclk] \
  [get_bd_pins axi_interconnect_0/ACLK] [get_bd_pins axi_interconnect_0/S00_ACLK] [get_bd_pins axi_interconnect_0/M00_ACLK] \
  [get_bd_pins axi_interconnect_0/M01_ACLK] [get_bd_pins axi_tft_0/s_axi_aclk] [get_bd_pins axi_tft_0/m_axi_aclk] \
  [get_bd_pins axi_timer_0/s_axi_aclk] [get_bd_pins axi_interconnect_0/M02_ACLK] [get_bd_pins axi_interconnect_0/M03_ACLK] \
  [get_bd_pins axi_interconnect_0/M04_ACLK] [get_bd_pins hmc1031_0/s_axi_aclk] [get_bd_pins ad9520_0/s_axi_aclk] \
  [get_bd_pins axi_interconnect_0/M05_ACLK] [get_bd_pins axi_interconnect_0/M06_ACLK] \
  [get_bd_pins axi_interconnect_0/M07_ACLK] [get_bd_pins dsp_hier/s_axi_aclk] [get_bd_pins axi_gpio_sw/s_axi_aclk] \
  [get_bd_pins axi_interconnect_0/M08_ACLK]
connect_bd_net [get_bd_ports sys_clk_p] [get_bd_pins sysclk_hier/sys_clk_p]
connect_bd_net [get_bd_ports sys_clk_n] [get_bd_pins sysclk_hier/sys_clk_n]
connect_bd_net -net clk_wiz_1_clk_125M [get_bd_pins sysclk_hier/clk_125M] \
  [get_bd_pins udp_bridge_hier/gtx_clk] [get_bd_pins ad9520_0/sync_clk] [get_bd_pins dsp_hier/syn_clk]
connect_bd_net -net clk_wiz_1_clk_125M90 [get_bd_pins sysclk_hier/clk_125M90] [get_bd_pins udp_bridge_hier/gtx_clk90]
connect_bd_net -net clk_wiz_1_clk_200M [get_bd_pins sysclk_hier/clk_200M] \
  [get_bd_pins udp_bridge_hier/delay_clk] [get_bd_pins ddr3_hier/clk_ref] [get_bd_pins dsp_hier/delay_clk]
connect_bd_net -net eth_mac_0_mdc [get_bd_pins udp_bridge_hier/mdc] [get_bd_ports mdc]
connect_bd_net -net eth_mac_0_mdio [get_bd_pins udp_bridge_hier/mdio] [get_bd_ports mdio]
connect_bd_net -net eth_mac_0_phy_rst [get_bd_pins udp_bridge_hier/phy_rst] [get_bd_ports phy_rst]
connect_bd_net -net clk_wiz_1_locked [get_bd_pins sysclk_hier/locked] [get_bd_pins udp_bridge_hier/dcm_locked] [get_bd_pins mb_hier/dcm_locked]
connect_bd_net -net proc_sys_reset_1_peripheral_aresetn [get_bd_pins mb_hier/peripheral_aresetn] \
  [get_bd_pins udp_bridge_hier/aresetn] [get_bd_pins ddr3_hier/peripheral_aresetn] \
  [get_bd_pins axi_interconnect_0/S00_ARESETN] [get_bd_pins axi_interconnect_0/M00_ARESETN] \
  [get_bd_pins axi_interconnect_0/M01_ARESETN] [get_bd_pins axi_tft_0/s_axi_aresetn] [get_bd_pins axi_tft_0/m_axi_aresetn] \
  [get_bd_pins axi_timer_0/s_axi_aresetn] [get_bd_pins axi_interconnect_0/M02_ARESETN] \
  [get_bd_pins axi_interconnect_0/M03_ARESETN] [get_bd_pins axi_interconnect_0/M04_ARESETN] \
  [get_bd_pins hmc1031_0/s_axi_aresetn] [get_bd_pins ad9520_0/s_axi_aresetn] [get_bd_pins axi_interconnect_0/M05_ARESETN] \
  [get_bd_pins axi_interconnect_0/M06_ARESETN] [get_bd_pins axi_interconnect_0/M07_ARESETN] \
  [get_bd_pins dsp_hier/s_axi_aresetn] [get_bd_pins axi_gpio_sw/s_axi_aresetn] [get_bd_pins axi_interconnect_0/M08_ARESETN]
connect_bd_net [get_bd_pins xlconcat_0/dout] [get_bd_pins mb_hier/irq]
connect_bd_net -net ARESETN_1 [get_bd_pins mb_hier/interconnect_aresetn] \
  [get_bd_pins ddr3_hier/interconnect_aresetn] [get_bd_pins axi_interconnect_0/ARESETN] \
  [get_bd_pins dsp_hier/interconnect_aresetn]
connect_bd_net [get_bd_pins axi_tft_0/ip2intc_irpt] [get_bd_pins xlconcat_0/In0]
connect_bd_net [get_bd_pins axi_timer_0/interrupt] [get_bd_pins xlconcat_0/In1]
connect_bd_net [get_bd_pins axi_timer_0/pwm0] [get_bd_ports tft_lcd_pwm]
connect_bd_net [get_bd_pins sysclk_hier/clk_10M] [get_bd_pins axi_tft_0/sys_tft_clk]
connect_bd_net -net probe_in0_0_1 [get_bd_ports usr_sw] [get_bd_pins axi_gpio_sw/gpio_io_i]
connect_bd_net [get_bd_pins sysclk_hier/clk_ref] [get_bd_ports clk_ref]
connect_bd_net -net syncron_0_gl_clk [get_bd_pins dsp_hier/glclk] [get_bd_ports glclk]
connect_bd_net -net syncron_0_csync [get_bd_pins dsp_hier/sync] [get_bd_pins ad9520_0/esync]
connect_bd_net [get_bd_pins sysclk_hier/clk_12_5M] [get_bd_pins dsp_hier/syn_clk_div]
connect_bd_net -net dsp_ioctl_0_dsp_resetn_all [get_bd_pins dsp_hier/dsp_reset_all] [get_bd_ports dsp_reset_all]
connect_bd_net -net dsp_ioctl_0_dsp_resetn [get_bd_pins dsp_hier/dsp_reset] [get_bd_ports dsp_reset]
connect_bd_net -net dsp_ioctl_0_dsp_irq0 [get_bd_pins dsp_hier/dsp_irq0] [get_bd_ports dsp_irq0]
connect_bd_net -net dsp_ioctl_0_dsp_irq1 [get_bd_pins dsp_hier/dsp_irq1] [get_bd_ports dsp_irq1]
connect_bd_net -net dsp_ioctl_0_dsp_dmar0 [get_bd_pins dsp_hier/dsp_dmar0] [get_bd_ports dsp_dmar0]
connect_bd_net -net dsp_ioctl_0_dsp_dmar1 [get_bd_pins dsp_hier/dsp_dmar1] [get_bd_ports dsp_dmar1]
connect_bd_net -net dsp_ioctl_0_dsp_ddca [get_bd_pins dsp_hier/dsp_coh_a] [get_bd_ports dsp_coh_a]
connect_bd_net -net dsp_ioctl_0_dsp_ddcb [get_bd_pins dsp_hier/dsp_coh_b] [get_bd_ports dsp_coh_b]
connect_bd_net [get_bd_pins dsp_hier/dma_irq] [get_bd_pins xlconcat_0/In2]
connect_bd_net [get_bd_pins sysclk_hier/clk_50M] [get_bd_pins dsp_hier/lxclk_ref_div4]
connect_bd_net -net probe_in0_0_2 [get_bd_ports dsp0_boot] [get_bd_pins dsp_hier/dsp0_boot]
connect_bd_net -net probe_in1_0_2 [get_bd_ports dsp1_boot] [get_bd_pins dsp_hier/dsp1_boot]
connect_bd_net [get_bd_pins xlconstant_0/dout] [get_bd_ports led]

# ---- address map ----
assign_bd_address -offset 0x80000000 -range 512M -target_address_space [get_bd_addr_spaces axi_tft_0/Video_data] [get_bd_addr_segs ddr3_hier/mig_7series_0/memmap/memaddr]
assign_bd_address -offset 0x80000000 -range 512M -target_address_space [get_bd_addr_spaces dsp_hier/link_hier/axi_dma/Data_S2MM] [get_bd_addr_segs ddr3_hier/mig_7series_0/memmap/memaddr]
assign_bd_address -offset 0x00000000 -range 256K -target_address_space [get_bd_addr_spaces mb_hier/microblaze_0/Data] [get_bd_addr_segs mb_hier/microblaze_0_local_memory/dlmb_bram_if_cntlr/SLMB/Mem]
assign_bd_address -offset 0x40000000 -range 64K -target_address_space [get_bd_addr_spaces mb_hier/microblaze_0/Data] [get_bd_addr_segs dsp_hier/link_hier/axi_gpio_0/S_AXI/Reg]
assign_bd_address -offset 0x40010000 -range 64K -target_address_space [get_bd_addr_spaces mb_hier/microblaze_0/Data] [get_bd_addr_segs axi_gpio_sw/S_AXI/Reg]
assign_bd_address -offset 0x41200000 -range 64K -target_address_space [get_bd_addr_spaces mb_hier/microblaze_0/Data] [get_bd_addr_segs mb_hier/microblaze_0_axi_intc/S_AXI/Reg]
assign_bd_address -offset 0x41400000 -range 4K -target_address_space [get_bd_addr_spaces mb_hier/microblaze_0/Data] [get_bd_addr_segs mb_hier/mdm_1/S_AXI/Reg]
assign_bd_address -offset 0x41C00000 -range 64K -target_address_space [get_bd_addr_spaces mb_hier/microblaze_0/Data] [get_bd_addr_segs mb_hier/axi_timer_0/S_AXI/Reg]
assign_bd_address -offset 0x41C10000 -range 64K -target_address_space [get_bd_addr_spaces mb_hier/microblaze_0/Data] [get_bd_addr_segs axi_timer_0/S_AXI/Reg]
assign_bd_address -offset 0x41E00000 -range 64K -target_address_space [get_bd_addr_spaces mb_hier/microblaze_0/Data] [get_bd_addr_segs dsp_hier/link_hier/axi_dma/S_AXI_LITE/Reg]
assign_bd_address -offset 0x44A00000 -range 64K -target_address_space [get_bd_addr_spaces mb_hier/microblaze_0/Data] [get_bd_addr_segs axi_tft_0/S_AXI_MM/Reg]
assign_bd_address -offset 0x44A10000 -range 64K -target_address_space [get_bd_addr_spaces mb_hier/microblaze_0/Data] [get_bd_addr_segs hmc1031_0/S_AXI/S_AXI_reg]
assign_bd_address -offset 0x44A20000 -range 64K -target_address_space [get_bd_addr_spaces mb_hier/microblaze_0/Data] [get_bd_addr_segs ad9520_0/S_AXI/Reg]
assign_bd_address -offset 0x44A30000 -range 64K -target_address_space [get_bd_addr_spaces mb_hier/microblaze_0/Data] [get_bd_addr_segs dsp_hier/dsp_ioctl_0/S_AXI/S_AXI_reg]
assign_bd_address -offset 0x44A40000 -range 64K -target_address_space [get_bd_addr_spaces mb_hier/microblaze_0/Data] [get_bd_addr_segs dsp_hier/syncron_0/S_AXI/S_AXI_reg]
assign_bd_address -offset 0x80000000 -range 512M -target_address_space [get_bd_addr_spaces mb_hier/microblaze_0/Data] [get_bd_addr_segs ddr3_hier/mig_7series_0/memmap/memaddr]
assign_bd_address -offset 0x00000000 -range 256K -target_address_space [get_bd_addr_spaces mb_hier/microblaze_0/Instruction] [get_bd_addr_segs mb_hier/microblaze_0_local_memory/ilmb_bram_if_cntlr/SLMB/Mem]

validate_bd_design
save_bd_design
